# Altium schematic sheet 43-PSU_SMU_HP.SchDoc
size 594 x 420 mm
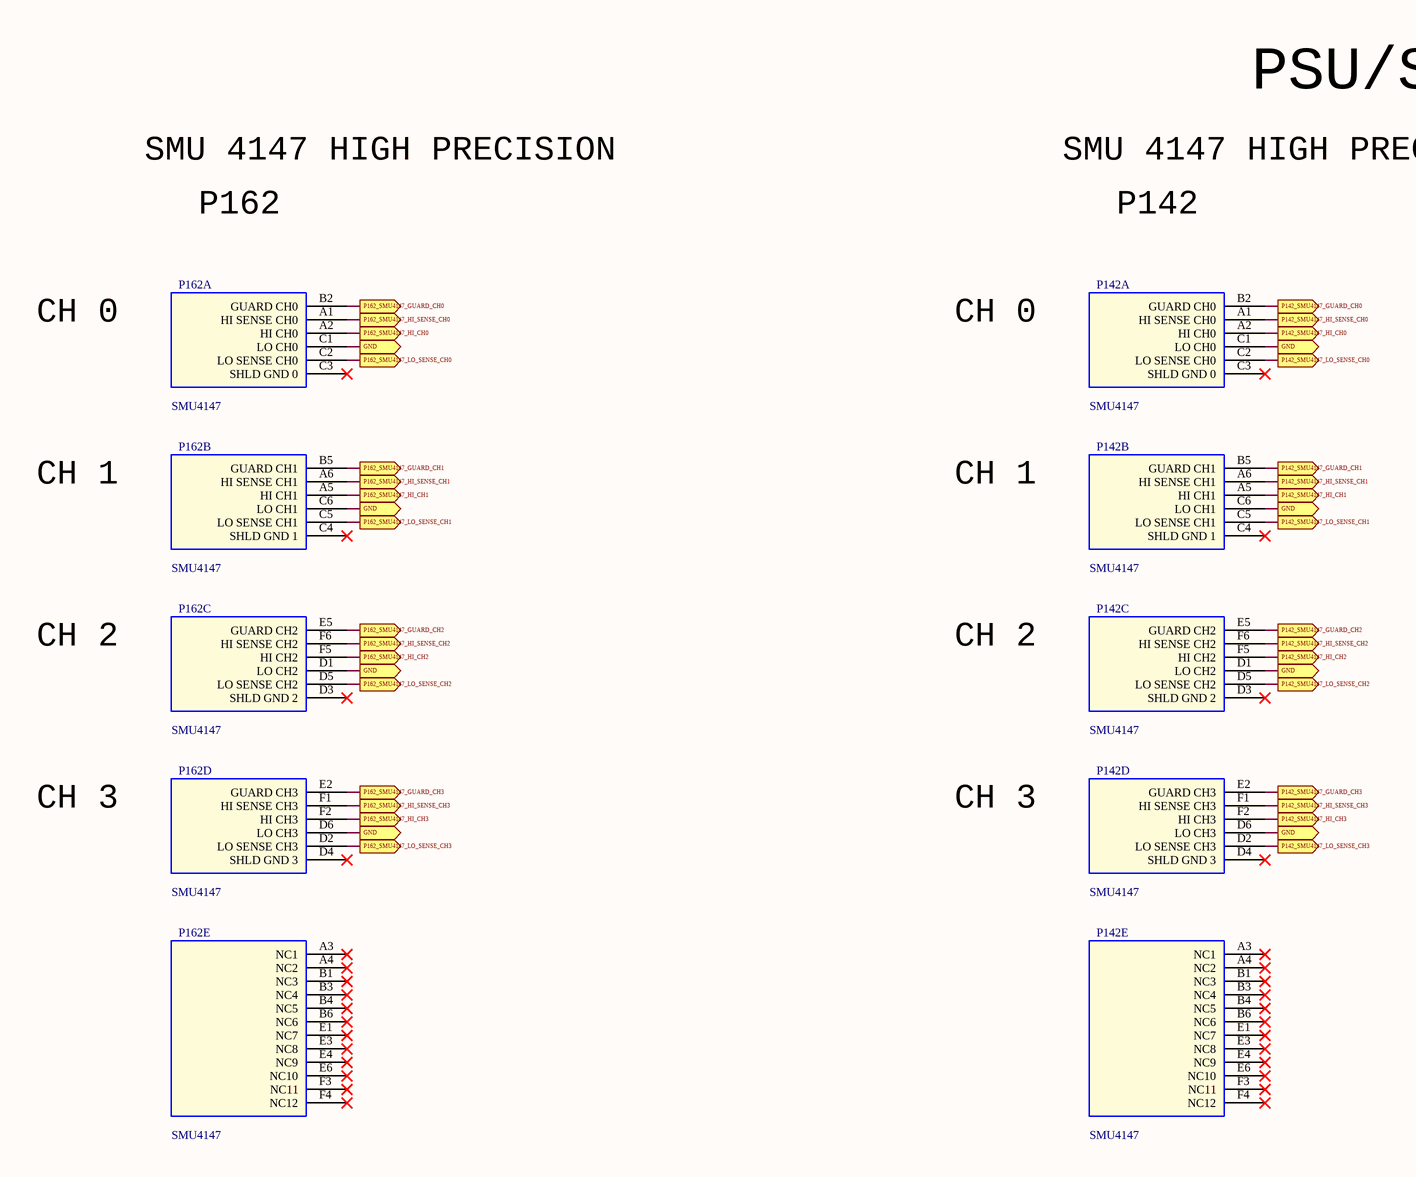
[diagram p0: 43-PSU_SMU_HP.SchDoc, top left]
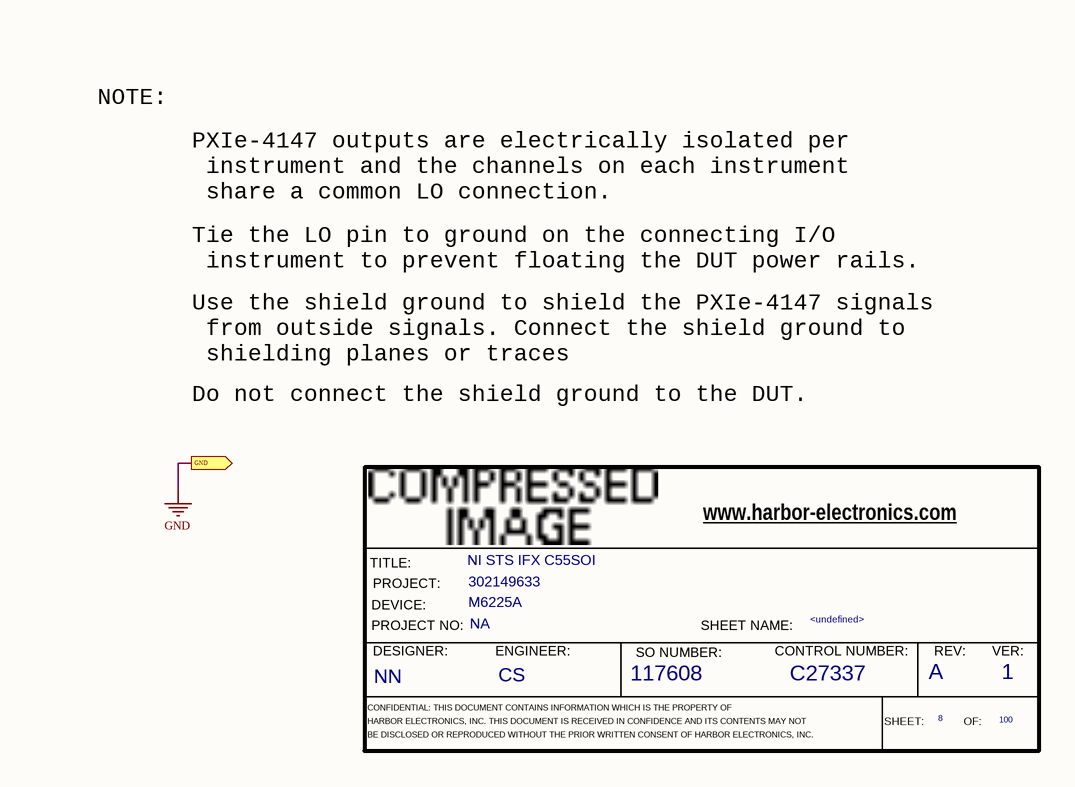
[diagram p1: 43-PSU_SMU_HP.SchDoc, bottom right]

## Parts
*  RevCode: A  Title: NI STS IFX C55SOI  Page Number: 8  Page Count: 100  Engineer: CS  Designer: NN  SO Number: 117608  Control Number: C27337  Version: 1  Page Name: <undefined>  PROJECT: 302149633  DEVICE: M6225A  PROJECT NO.: NA  (hidden comment: HE_DEFAULT)  (graphical)
P142  SMU4147  [285092A-08_36PIN]  (parts A,B,C,D,E of 5)
P162  SMU4147  [285092A-08_36PIN]  (parts A,B,C,D,E of 5)

## Ports
GND (out), P142_SMU4147_GUARD_CH0 (out), P142_SMU4147_GUARD_CH1 (out), P142_SMU4147_GUARD_CH2 (out), P142_SMU4147_GUARD_CH3 (out), P142_SMU4147_HI_CH0 (out), P142_SMU4147_HI_CH1 (out), P142_SMU4147_HI_CH2 (out), P142_SMU4147_HI_CH3 (out), P142_SMU4147_HI_SENSE_CH0 (out), P142_SMU4147_HI_SENSE_CH1 (out), P142_SMU4147_HI_SENSE_CH2 (out), P142_SMU4147_HI_SENSE_CH3 (out), P142_SMU4147_LO_SENSE_CH0 (out), P142_SMU4147_LO_SENSE_CH1 (out), P142_SMU4147_LO_SENSE_CH2 (out), P142_SMU4147_LO_SENSE_CH3 (out), P162_SMU4147_GUARD_CH0 (out), P162_SMU4147_GUARD_CH1 (out), P162_SMU4147_GUARD_CH2 (out), P162_SMU4147_GUARD_CH3 (out), P162_SMU4147_HI_CH0 (out), P162_SMU4147_HI_CH1 (out), P162_SMU4147_HI_CH2 (out), P162_SMU4147_HI_CH3 (out), P162_SMU4147_HI_SENSE_CH0 (out), P162_SMU4147_HI_SENSE_CH1 (out), P162_SMU4147_HI_SENSE_CH2 (out), P162_SMU4147_HI_SENSE_CH3 (out), P162_SMU4147_LO_SENSE_CH0 (out), P162_SMU4147_LO_SENSE_CH1 (out), P162_SMU4147_LO_SENSE_CH2 (out), P162_SMU4147_LO_SENSE_CH3 (out)

## Nets
GND: P142.C1(LO_CH0) P142.C6(LO_CH1) P142.D1(LO_CH2) P142.D6(LO_CH3) P162.C1(LO_CH0) P162.C6(LO_CH1) P162.D1(LO_CH2) P162.D6(LO_CH3) ; port GND
P142_SMU4147_GUARD_CH0: P142.B2(GUARD_CH0) ; port P142_SMU4147_GUARD_CH0
P142_SMU4147_GUARD_CH1: P142.B5(GUARD_CH1) ; port P142_SMU4147_GUARD_CH1
P142_SMU4147_GUARD_CH2: P142.E5(GUARD_CH2) ; port P142_SMU4147_GUARD_CH2
P142_SMU4147_GUARD_CH3: P142.E2(GUARD_CH3) ; port P142_SMU4147_GUARD_CH3
P142_SMU4147_HI_CH0: P142.A2(HI_CH0) ; port P142_SMU4147_HI_CH0
P142_SMU4147_HI_CH1: P142.A5(HI_CH1) ; port P142_SMU4147_HI_CH1
P142_SMU4147_HI_CH2: P142.F5(HI_CH2) ; port P142_SMU4147_HI_CH2
P142_SMU4147_HI_CH3: P142.F2(HI_CH3) ; port P142_SMU4147_HI_CH3
P142_SMU4147_HI_SENSE_CH0: P142.A1(HI_SENSE_CH0) ; port P142_SMU4147_HI_SENSE_CH0
P142_SMU4147_HI_SENSE_CH1: P142.A6(HI_SENSE_CH1) ; port P142_SMU4147_HI_SENSE_CH1
P142_SMU4147_HI_SENSE_CH2: P142.F6(HI_SENSE_CH2) ; port P142_SMU4147_HI_SENSE_CH2
P142_SMU4147_HI_SENSE_CH3: P142.F1(HI_SENSE_CH3) ; port P142_SMU4147_HI_SENSE_CH3
P142_SMU4147_LO_SENSE_CH0: P142.C2(LO_SENSE_CH0) ; port P142_SMU4147_LO_SENSE_CH0
P142_SMU4147_LO_SENSE_CH1: P142.C5(LO_SENSE_CH1) ; port P142_SMU4147_LO_SENSE_CH1
P142_SMU4147_LO_SENSE_CH2: P142.D5(LO_SENSE_CH2) ; port P142_SMU4147_LO_SENSE_CH2
P142_SMU4147_LO_SENSE_CH3: P142.D2(LO_SENSE_CH3) ; port P142_SMU4147_LO_SENSE_CH3
P162_SMU4147_GUARD_CH0: P162.B2(GUARD_CH0) ; port P162_SMU4147_GUARD_CH0
P162_SMU4147_GUARD_CH1: P162.B5(GUARD_CH1) ; port P162_SMU4147_GUARD_CH1
P162_SMU4147_GUARD_CH2: P162.E5(GUARD_CH2) ; port P162_SMU4147_GUARD_CH2
P162_SMU4147_GUARD_CH3: P162.E2(GUARD_CH3) ; port P162_SMU4147_GUARD_CH3
P162_SMU4147_HI_CH0: P162.A2(HI_CH0) ; port P162_SMU4147_HI_CH0
P162_SMU4147_HI_CH1: P162.A5(HI_CH1) ; port P162_SMU4147_HI_CH1
P162_SMU4147_HI_CH2: P162.F5(HI_CH2) ; port P162_SMU4147_HI_CH2
P162_SMU4147_HI_CH3: P162.F2(HI_CH3) ; port P162_SMU4147_HI_CH3
P162_SMU4147_HI_SENSE_CH0: P162.A1(HI_SENSE_CH0) ; port P162_SMU4147_HI_SENSE_CH0
P162_SMU4147_HI_SENSE_CH1: P162.A6(HI_SENSE_CH1) ; port P162_SMU4147_HI_SENSE_CH1
P162_SMU4147_HI_SENSE_CH2: P162.F6(HI_SENSE_CH2) ; port P162_SMU4147_HI_SENSE_CH2
P162_SMU4147_HI_SENSE_CH3: P162.F1(HI_SENSE_CH3) ; port P162_SMU4147_HI_SENSE_CH3
P162_SMU4147_LO_SENSE_CH0: P162.C2(LO_SENSE_CH0) ; port P162_SMU4147_LO_SENSE_CH0
P162_SMU4147_LO_SENSE_CH1: P162.C5(LO_SENSE_CH1) ; port P162_SMU4147_LO_SENSE_CH1
P162_SMU4147_LO_SENSE_CH2: P162.D5(LO_SENSE_CH2) ; port P162_SMU4147_LO_SENSE_CH2
P162_SMU4147_LO_SENSE_CH3: P162.D2(LO_SENSE_CH3) ; port P162_SMU4147_LO_SENSE_CH3

Not connected (* = marked no-connect by the designer): P142 A3(NC1)* A4(NC2)* B1(NC3)* B3(NC4)* B4(NC5)* B6(NC6)* C3(SHLD_GND_0)* C4(SHLD_GND_1)* D3(SHLD_GND_2)* D4(SHLD_GND_3)* E1(NC7)* E3(NC8)* E4(NC9)* E6(NC10)* F3(NC11)* F4(NC12)*; P162 A3(NC1)* A4(NC2)* B1(NC3)* B3(NC4)* B4(NC5)* B6(NC6)* C3(SHLD_GND_0)* C4(SHLD_GND_1)* D3(SHLD_GND_2)* D4(SHLD_GND_3)* E1(NC7)* E3(NC8)* E4(NC9)* E6(NC10)* F3(NC11)* F4(NC12)*

## Notes on the sheet
- PSU/SMU
- SMU 4147 HIGH PRECISION
- P162
- P142
- CH 0
- CH 1
- CH 2
- CH 3
- NOTE:
- PXIe-4147 outputs are electrically isolated per
  instrument and the channels on each instrument
  share a common LO connection.
- Tie the LO pin to ground on the connecting I/O
  instrument to prevent floating the DUT power rails.
- Use the shield ground to shield the PXIe-4147 signals
  from outside signals. Connect the shield ground to
  shielding planes or traces
- Do not connect the shield ground to the DUT.
- (in symbol HE_DEFAULT) www.harbor-electronics.com; TITLE:; PROJECT:; DEVICE:; PROJECT NO:; SHEET NAME:; DESIGNER:; ENGINEER:; SO NUMBER:; CONTROL NUMBER:; REV:; VER:; CONFIDENTIAL: THIS DOCUMENT CONTAINS INFORMATION WHICH IS THE PROPERTY OF; HARBOR ELECTRONICS, INC. THIS DOCUMENT IS RECEIVED IN CONFIDENCE AND ITS CONTENTS MAY NOT; SHEET:; OF:; BE DISCLOSED OR REPRODUCED WITHOUT THE PRIOR WRITTEN CONSENT OF HARBOR ELECTRONICS, INC.

## Library data of the parts
* = HE_DEFAULT: Page Size: X; OrgAddr4: Fax: +1 602-431-9633; OrgAddr1: 4050 E. Cotton Center Blvd., Suite 33; OrgAddr2: Phoenix, Arizona 85040 U.S.A.; OrgAddr3: Phone: +1 602-438-1112; Doc: <Title Name>; OrgName: HARBOR
P142 P162 = SMU4147: SPLIT_INST: TRUE; SWAP_INFO: (S1+S2+S3+S4+S5); PCB Footprint: 285092A-08_36PIN